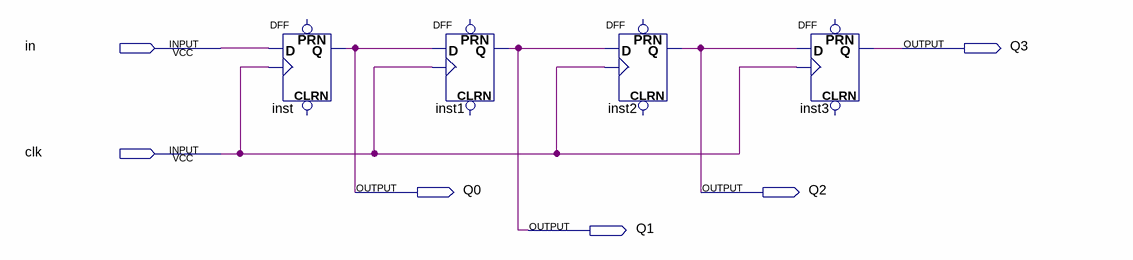
[diagram p0: schematic sheet]
// Quartus schematic shiftreg4.bdf as structural Verilog: 4 symbols, 6 pins
module shiftreg4 (
  input  in,
  input  clk,
  output Q3,
  output Q0,
  output Q2,
  output Q1
);

  DFF inst (.CLK(clk), .D(in), .Q(Q0));  // open: CLRN, PRN
  DFF inst1 (.CLK(clk), .D(Q0), .Q(Q1));  // open: CLRN, PRN
  DFF inst2 (.CLK(clk), .D(Q1), .Q(Q2));  // open: CLRN, PRN
  DFF inst3 (.CLK(clk), .D(Q2), .Q(Q3));  // open: CLRN, PRN
endmodule
